# Altium schematic sheet chip.SchDoc
size A; SheetNumber: 3; SheetTotal: 3
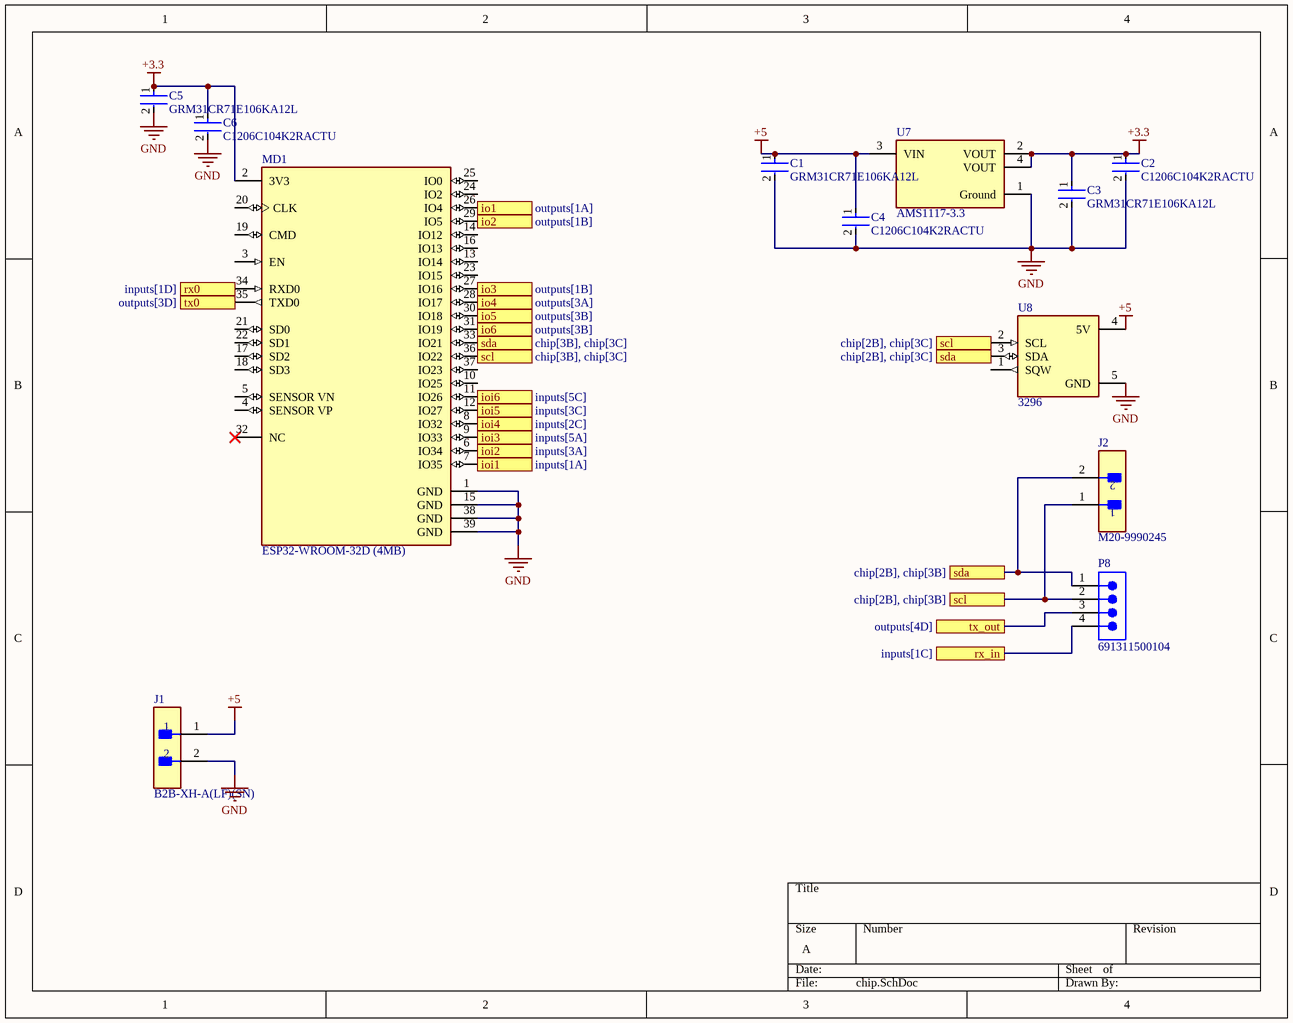
[diagram p0: chip.SchDoc]

## Parts
C1  GRM31CR71E106KA12L  [FP-GRM31C-0_2-e0_3_0_8-MFG]
C2  C1206C104K2RACTU  [FP-C1206C-EB-MFG]
C3  GRM31CR71E106KA12L  [FP-GRM31C-0_2-e0_3_0_8-MFG]
C4  C1206C104K2RACTU  [FP-C1206C-EB-MFG]
C5  GRM31CR71E106KA12L  [FP-GRM31C-0_2-e0_3_0_8-MFG]
C6  C1206C104K2RACTU  [FP-C1206C-EB-MFG]
J1  B2B-XH-A(LF)(SN)  [FP-B2B-XH-A_LF_SN-MFG]
J2  M20-9990245  [FP-M20-9990245-MFG]
MD1  ESP32-WROOM-32D (4MB)  [FP-ESP32-WROOM-32D_4MB-MFG]
P8  691311500104  [691311500104]
U7  AMS1117-3.3  [FP-AMS1117-IPC_C]
U8  3296  [MODULE_3296]

## Ports
io1 (see outputs[1A]), io2 (see outputs[1B]), io3 (see outputs[1B]), io4 (see outputs[3A]), io5 (see outputs[3B]), io6 (see outputs[3B]), ioi1 (see inputs[1A]), ioi2 (see inputs[3A]), ioi3 (see inputs[5A]), ioi4 (see inputs[2C]), ioi5 (see inputs[3C]), ioi6 (see inputs[5C]), rx0 (see inputs[1D]), rx_in (see inputs[1C]), scl (see chip[2B], chip[3B]), scl (see chip[2B], chip[3C]), scl (see chip[3B], chip[3C]), sda (see chip[2B], chip[3B]), sda (see chip[2B], chip[3C]), sda (see chip[3B], chip[3C]), tx0 (see outputs[3D]), tx_out (see outputs[4D])

## Nets
+3.3: C2.1 C3.1 C5.1 C6.1 MD1.2(3V3) U7.2(VOUT) U7.4(VOUT)
+5: C1.1 C4.1 J1.1 U7.3(VIN) U8.4(5V)
GND: C1.2 C2.2 C3.2 C4.2 C5.2 C6.2 J1.2 MD1.1(GND) MD1.15(GND) MD1.38(GND) MD1.39(GND) U7.1(Ground) U8.5(GND)
io1: MD1.26(IO4) ; port io1
io2: MD1.29(IO5) ; port io2
io3: MD1.27(IO16) ; port io3
io4: MD1.28(IO17) ; port io4
io5: MD1.30(IO18) ; port io5
io6: MD1.31(IO19) ; port io6
ioi1: MD1.7(IO35) ; port ioi1
ioi2: MD1.6(IO34) ; port ioi2
ioi3: MD1.9(IO33) ; port ioi3
ioi4: MD1.8(IO32) ; port ioi4
ioi5: MD1.12(IO27) ; port ioi5
ioi6: MD1.11(IO26) ; port ioi6
rx0: MD1.34(RXD0) ; port rx0
rx_in: P8.4 ; port rx_in
scl: J2.1 MD1.36(IO22) P8.2 U8.2(SCL) ; port scl
sda: J2.2 MD1.33(IO21) P8.1 U8.3(SDA) ; port sda
tx0: MD1.35(TXD0) ; port tx0
tx_out: P8.3 ; port tx_out

Not connected (* = marked no-connect by the designer): MD1 3(EN) 4(SENSOR_VP) 5(SENSOR_VN) 10(IO25) 13(IO14) 14(IO12) 16(IO13) 17(SD2) 18(SD3) 19(CMD) 20(CLK) 21(SD0) 22(SD1) 23(IO15) 24(IO2) 25(IO0) 32(NC)* 37(IO23); U8 1(SQW)

## Library data of the parts
C1 C3 C5 = CMP-06035-003589-1: Chip Multilayer Ceramic Capacitors for General Purpose, 1206, 10uF, X7R, 15%, 10%, 25V; Case Code (Imperial): 1206; Voltage Rating (DC): 25V; Voltage Rating: 25V; Length: 3.2mm; Lead Free: Lead Free; Thickness: 0.071inch; Package Quantity: 1; Width: 1.6mm; Max Operating Temperature: 125°C; Number of Pins: 2; Height: 1.6mm; Case Code (Metric): 3216; REACH SVHC: No SVHC; Radiation Hardening: No; Case/Package: 1206; Material: Ceramic; Tolerance: 10%; Voltage: 25V; Mount: Surface Mount; Packaging: Tape and Reel; Dielectric: X7R; Termination: SMD/SMT; Min Operating Temperature: -55°C; Capacitance: 10uF; Depth: 1.6mm
C2 C4 C6 = CMP-1037-04222-2: CAP CER 0.1UF 200V 10% X7R 1206; Manufacturer: KEMET; Automotive Grade: Grade 0; Tolerance: 0.1; Value: 0.10 μF; Material: Ceramic; Temperature Coefficient: 15%; Description: C1206 0.10 μF X7R 10.00% 200 V; Automotive: Yes; Temperature Characteristic: X7R; Digikey Description: CAP CER 0.1UF 200V 10% X7R 1206; ComponentLink2URL: https://content.kemet.com/datasheets/KEM_C1007_X8R_ULTRA_150C_SMD.pdf; Voltage Rating: 200 V; Manufacturer Part Number: C1206C104K2RACTU; Temperature Range High: +150°C; Device Class L1: Passive Components; Octopart: https://octopart.com/c1206c104k2ractu-kemet-9138344; Temperature: -55°C to +150°C; Height: 0.88mm; Device Class L3: Ceramic Capacitors; Lead Free: Yes; Package: C1206C-EB; Category: Cap; Temperature Range Low: -55°C; Mouser Description: Multilayer Ceramic Capacitors MLCC - SMD/SMT 200volts 0.1uF X7R 10%; Ipc Land Pattern Name: CAPC320160X78; Capacitance: 0.10 μF; RoHS: TRUE; ComponentLink2Description: Datasheet; Device Class L2: Capacitors
J1 = CMP-2000-05888-3: CONN HEADER VERT 2POS 2.5MM; Current Rating: 3A; Voltage Rating: 250V; Number of Contacts: 2; Contact Resistance: 20mR; Wire/Cable Gauge: 22AWG; Insulation Resistance: 1GR; Connector Type: Male Pin; Packaging: Bulk; Contact Material: Brass; Lead Free: Lead Free; Orientation: Straight; Contact Plating: Tin; Max Current Rating: 3A; Termination: Solder; Fastening Type: Detent; Depth: 5.75mm; Housing Material: Polyamide; REACH SVHC: No SVHC; Series: XH; Voltage Rating (AC): 250V; Number of Positions: 2; Color: Natural; Contact Type: Male Pin; Max Voltage Rating (DC): 250V; Pitch: 2.5mm; Lead Pitch: 2.5mm; Mount: Through Hole; Max Operating Temperature: 85°C; Length: 7.4mm; Max Voltage Rating (AC): 250V; Min Operating Temperature: -25°C; Number of Rows: 1; Housing Color: White
J2 = CMP-15831-000105-1: CONN HEADER VERT 2POS 2.54MM; Working Voltage: 750V; Gender: Male; Number of Poles: 2; Current Rating: 3A; Mated Stacking Heights: 16.54mm; Contact Resistance: 25mR; Connector Type: Male Pin; Insulation Resistance: 10GR; Mating Cycles: 300; Voltage: 50V; Flammability Rating: UL94 V-0; Pitch: 2.54mm; Series: M20; Number of Contacts: 2; Height: 0.12inch; Min Operating Temperature: -40°C; Contact Finish - Mating: GOLD; Number of Positions: 2; Number of Rows: 1; Packaging: Bulk; Package Quantity: 1000; Voltage Rating (AC): 750V; Current: 3A; Mount: Through Hole; Case/Package: SIL; Orientation: Straight; Contact Shape: Square; Weight: 0.25lb; Radiation Hardening: No; Fastening Type: Pull; Length: 5.08mm; Depth: 2.54mm; Contact Mating Length: 0.24inch; Housing Material: Nylon; Reach SVHC Compliant: Yes; Insulation Material: Nylon; Color: Black; Width: 0.25inch; Insulation Color: Black; Contact Material: Brass; Contact Type: Male Pin; Termination: Solder; Max Operating Temperature: 105°C; Contact Plating: Gold; Housing Color: Black; Max Current Rating: 3A; Lead Pitch: 2.54mm
MD1 = CMP-194065-000009-1: RX TXRX MOD WIFI TRACE ANT SMD
P8 = CMP-1502-02148-2: NexarPartId: 8917749; Pitch: 5.08mm; Number of Positions Per Level: 4; Gender: Male; Voltage: 300V; Current: 20A; Number of Levels: 1; Orientation: Vertical; Number of Pins: 4; Mount: Through Hole; Number of Contacts: 4; Length: 8.5mm; Number of Rows: 1; Contact Plating: Tin; Color: Green; Termination: Solder; Contact Material: Brass; REACH SVHC: Unknown; RoHS: Compliant; Lead Pitch: 5.08mm; Width: 22.32mm; Height: 12mm; Packaging: Box
U7 = CMP-209535-000001-1: LDO Voltage Regulators 1A, 3.3V; Manufacturer: Advanced Monolithic Systems; Dropout Voltage: 1.1V; Output Type: Fixed; Nominal Supply Current: 5mA; Max Power Dissipation: 1.2W; Max Supply Voltage: 15V; Number Of Outputs: 1; Standoff Height: 0.64mm; Max Junction Temp: +125°C; Height: 1.8mm; Package: AMS1117; Device Class L2: Power Management ICs; ComponentLink2Description: Datasheet; ComponentLink2URL: http://www.advanced-monolithic.com/pdf/ds1117.pdf; Category: IC; RoHS: TRUE; Automotive: No; Device Class L1: Integrated Circuits (ICs); Output Current: 1A; Device Class L3: Voltage Regulators - Linear; Temperature: -40°C to +125°C; Output Voltage: 3.3V; Manufacturer Part Number: AMS1117-3.3; Temperature Range Low: -40°C; Octopart: https://octopart.com/ams1117-3.3-advanced+monolithic+systems-25899300; Lead Free: Yes; Ipc Land Pattern Name: SOT229P700X180-4; Temperature Range High: +125°C
U8 = 3296: DS1307 Real Time Clock (RTC) Timing Evaluation Board; MF: Adafruit; Package: None; Price: None; Check_prices: https://www.snapeda.com/parts/3296/Adafruit+Industries/view-part/?ref=eda; Value: *; SnapEDA_Link: https://www.snapeda.com/parts/3296/Adafruit+Industries/view-part/?ref=snap; MP: 3296; Availability: In Stock; Purchase-URL: https://pricing.snapeda.com/search/part/3296/?ref=eda